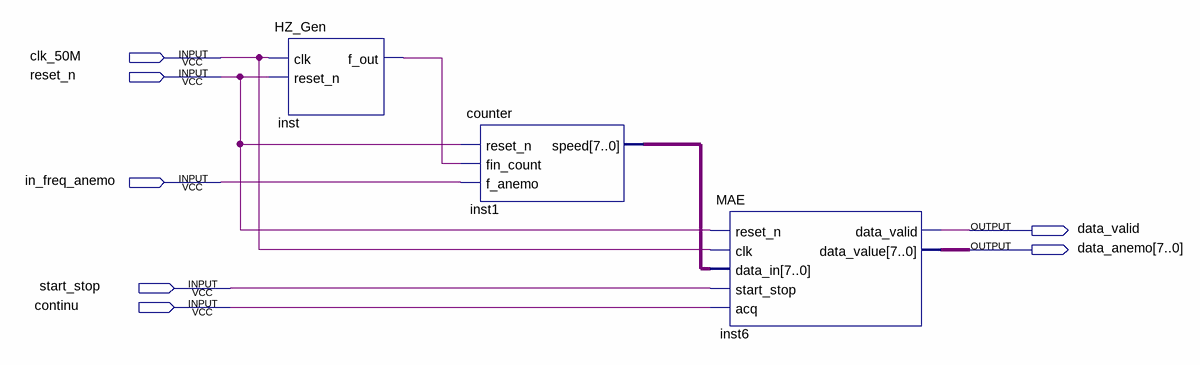
[diagram p0: schematic sheet]
// Quartus schematic full.bdf as structural Verilog: 3 symbols, 7 pins
module full (
  input  clk_50M,
  input  reset_n,
  input  in_freq_anemo,
  input  start_stop,
  input  continu,
  output data_valid,
  output [7:0] data_anemo
);

  wire inst_f_out;
  wire [7:0] inst1_speed;

  HZ_Gen inst (.clk(clk_50M), .reset_n(reset_n), .f_out(inst_f_out));
  counter inst1 (.reset_n(reset_n), .fin_count(inst_f_out), .f_anemo(in_freq_anemo), .speed(inst1_speed));
  MAE inst6 (
    .reset_n(reset_n), .clk(clk_50M), .data_in(inst1_speed), .start_stop(start_stop), .acq(continu),
    .data_valid(data_valid), .data_value(data_anemo));
endmodule
